# EAGLE design protoboard-63 (EAGLE 6.5.0)
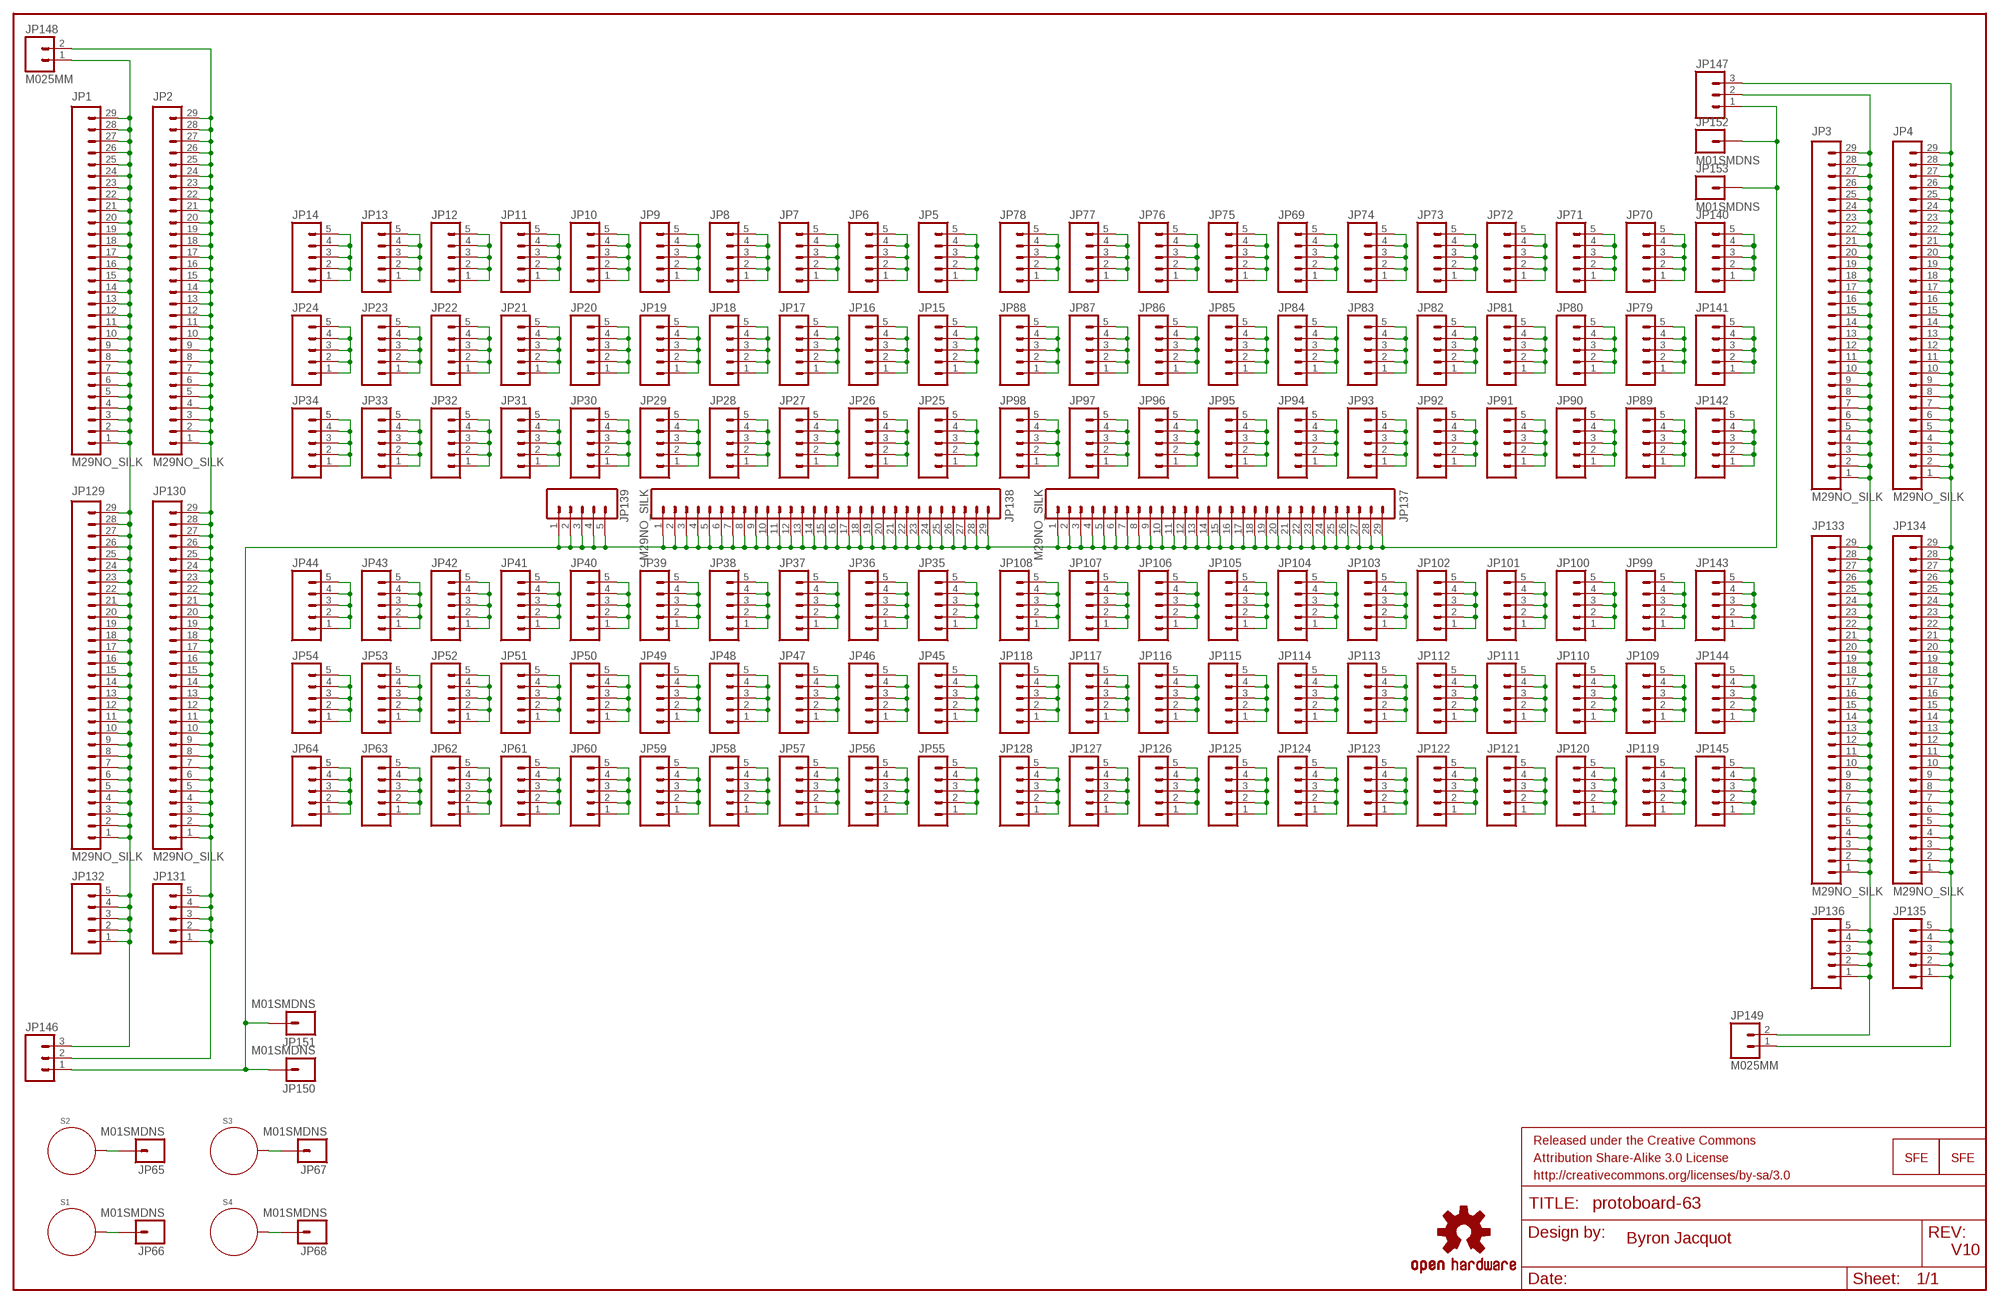
[diagram p0: schematic, sheet 1]

## Parts
FRAME2  FRAME-LEDGER  [CREATIVE_COMMONS]
JP1  M29NO_SILK  [1X29_NO_SILK]
JP2  M29NO_SILK  [1X29_NO_SILK]
JP3  M29NO_SILK  [1X29_NO_SILK]
JP4  M29NO_SILK  [1X29_NO_SILK]
JP5  M05NO_SILK  [1X05_NO_SILK]
JP6  M05NO_SILK  [1X05_NO_SILK]
JP7  M05NO_SILK  [1X05_NO_SILK]
JP8  M05NO_SILK  [1X05_NO_SILK]
JP9  M05NO_SILK  [1X05_NO_SILK]
JP10  M05NO_SILK  [1X05_NO_SILK]
JP11  M05NO_SILK  [1X05_NO_SILK]
JP12  M05NO_SILK  [1X05_NO_SILK]
JP13  M05NO_SILK  [1X05_NO_SILK]
JP14  M05NO_SILK  [1X05_NO_SILK]
JP15  M05NO_SILK  [1X05_NO_SILK]
JP16  M05NO_SILK  [1X05_NO_SILK]
JP17  M05NO_SILK  [1X05_NO_SILK]
JP18  M05NO_SILK  [1X05_NO_SILK]
JP19  M05NO_SILK  [1X05_NO_SILK]
JP20  M05NO_SILK  [1X05_NO_SILK]
JP21  M05NO_SILK  [1X05_NO_SILK]
JP22  M05NO_SILK  [1X05_NO_SILK]
JP23  M05NO_SILK  [1X05_NO_SILK]
JP24  M05NO_SILK  [1X05_NO_SILK]
JP25  M05NO_SILK  [1X05_NO_SILK]
JP26  M05NO_SILK  [1X05_NO_SILK]
JP27  M05NO_SILK  [1X05_NO_SILK]
JP28  M05NO_SILK  [1X05_NO_SILK]
JP29  M05NO_SILK  [1X05_NO_SILK]
JP30  M05NO_SILK  [1X05_NO_SILK]
JP31  M05NO_SILK  [1X05_NO_SILK]
JP32  M05NO_SILK  [1X05_NO_SILK]
JP33  M05NO_SILK  [1X05_NO_SILK]
JP34  M05NO_SILK  [1X05_NO_SILK]
JP35  M05NO_SILK  [1X05_NO_SILK]
JP36  M05NO_SILK  [1X05_NO_SILK]
JP37  M05NO_SILK  [1X05_NO_SILK]
JP38  M05NO_SILK  [1X05_NO_SILK]
JP39  M05NO_SILK  [1X05_NO_SILK]
JP40  M05NO_SILK  [1X05_NO_SILK]
JP41  M05NO_SILK  [1X05_NO_SILK]
JP42  M05NO_SILK  [1X05_NO_SILK]
JP43  M05NO_SILK  [1X05_NO_SILK]
JP44  M05NO_SILK  [1X05_NO_SILK]
JP45  M05NO_SILK  [1X05_NO_SILK]
JP46  M05NO_SILK  [1X05_NO_SILK]
JP47  M05NO_SILK  [1X05_NO_SILK]
JP48  M05NO_SILK  [1X05_NO_SILK]
JP49  M05NO_SILK  [1X05_NO_SILK]
JP50  M05NO_SILK  [1X05_NO_SILK]
JP51  M05NO_SILK  [1X05_NO_SILK]
JP52  M05NO_SILK  [1X05_NO_SILK]
JP53  M05NO_SILK  [1X05_NO_SILK]
JP54  M05NO_SILK  [1X05_NO_SILK]
JP55  M05NO_SILK  [1X05_NO_SILK]
JP56  M05NO_SILK  [1X05_NO_SILK]
JP57  M05NO_SILK  [1X05_NO_SILK]
JP58  M05NO_SILK  [1X05_NO_SILK]
JP59  M05NO_SILK  [1X05_NO_SILK]
JP60  M05NO_SILK  [1X05_NO_SILK]
JP61  M05NO_SILK  [1X05_NO_SILK]
JP62  M05NO_SILK  [1X05_NO_SILK]
JP63  M05NO_SILK  [1X05_NO_SILK]
JP64  M05NO_SILK  [1X05_NO_SILK]
JP65  M01SMDNS  [1X01NS]
JP66  M01SMDNS  [1X01NS]
JP67  M01SMDNS  [1X01NS]
JP68  M01SMDNS  [1X01NS]
JP69  M05NO_SILK  [1X05_NO_SILK]
JP70  M05NO_SILK  [1X05_NO_SILK]
JP71  M05NO_SILK  [1X05_NO_SILK]
JP72  M05NO_SILK  [1X05_NO_SILK]
JP73  M05NO_SILK  [1X05_NO_SILK]
JP74  M05NO_SILK  [1X05_NO_SILK]
JP75  M05NO_SILK  [1X05_NO_SILK]
JP76  M05NO_SILK  [1X05_NO_SILK]
JP77  M05NO_SILK  [1X05_NO_SILK]
JP78  M05NO_SILK  [1X05_NO_SILK]
JP79  M05NO_SILK  [1X05_NO_SILK]
JP80  M05NO_SILK  [1X05_NO_SILK]
JP81  M05NO_SILK  [1X05_NO_SILK]
JP82  M05NO_SILK  [1X05_NO_SILK]
JP83  M05NO_SILK  [1X05_NO_SILK]
JP84  M05NO_SILK  [1X05_NO_SILK]
JP85  M05NO_SILK  [1X05_NO_SILK]
JP86  M05NO_SILK  [1X05_NO_SILK]
JP87  M05NO_SILK  [1X05_NO_SILK]
JP88  M05NO_SILK  [1X05_NO_SILK]
JP89  M05NO_SILK  [1X05_NO_SILK]
JP90  M05NO_SILK  [1X05_NO_SILK]
JP91  M05NO_SILK  [1X05_NO_SILK]
JP92  M05NO_SILK  [1X05_NO_SILK]
JP93  M05NO_SILK  [1X05_NO_SILK]
JP94  M05NO_SILK  [1X05_NO_SILK]
JP95  M05NO_SILK  [1X05_NO_SILK]
JP96  M05NO_SILK  [1X05_NO_SILK]
JP97  M05NO_SILK  [1X05_NO_SILK]
JP98  M05NO_SILK  [1X05_NO_SILK]
JP99  M05NO_SILK  [1X05_NO_SILK]
JP100  M05NO_SILK  [1X05_NO_SILK]
JP101  M05NO_SILK  [1X05_NO_SILK]
JP102  M05NO_SILK  [1X05_NO_SILK]
JP103  M05NO_SILK  [1X05_NO_SILK]
JP104  M05NO_SILK  [1X05_NO_SILK]
JP105  M05NO_SILK  [1X05_NO_SILK]
JP106  M05NO_SILK  [1X05_NO_SILK]
JP107  M05NO_SILK  [1X05_NO_SILK]
JP108  M05NO_SILK  [1X05_NO_SILK]
JP109  M05NO_SILK  [1X05_NO_SILK]
JP110  M05NO_SILK  [1X05_NO_SILK]
JP111  M05NO_SILK  [1X05_NO_SILK]
JP112  M05NO_SILK  [1X05_NO_SILK]
JP113  M05NO_SILK  [1X05_NO_SILK]
JP114  M05NO_SILK  [1X05_NO_SILK]
JP115  M05NO_SILK  [1X05_NO_SILK]
JP116  M05NO_SILK  [1X05_NO_SILK]
JP117  M05NO_SILK  [1X05_NO_SILK]
JP118  M05NO_SILK  [1X05_NO_SILK]
JP119  M05NO_SILK  [1X05_NO_SILK]
JP120  M05NO_SILK  [1X05_NO_SILK]
JP121  M05NO_SILK  [1X05_NO_SILK]
JP122  M05NO_SILK  [1X05_NO_SILK]
JP123  M05NO_SILK  [1X05_NO_SILK]
JP124  M05NO_SILK  [1X05_NO_SILK]
JP125  M05NO_SILK  [1X05_NO_SILK]
JP126  M05NO_SILK  [1X05_NO_SILK]
JP127  M05NO_SILK  [1X05_NO_SILK]
JP128  M05NO_SILK  [1X05_NO_SILK]
JP129  M29NO_SILK  [1X29_NO_SILK]
JP130  M29NO_SILK  [1X29_NO_SILK]
JP131  M05NO_SILK  [1X05_NO_SILK]
JP132  M05NO_SILK  [1X05_NO_SILK]
JP133  M29NO_SILK  [1X29_NO_SILK]
JP134  M29NO_SILK  [1X29_NO_SILK]
JP135  M05NO_SILK  [1X05_NO_SILK]
JP136  M05NO_SILK  [1X05_NO_SILK]
JP137  M29NO_SILK  [1X29_NO_SILK]
JP138  M29NO_SILK  [1X29_NO_SILK]
JP139  M05NO_SILK  [1X05_NO_SILK]
JP140  M05NO_SILK  [1X05_NO_SILK]
JP141  M05NO_SILK  [1X05_NO_SILK]
JP142  M05NO_SILK  [1X05_NO_SILK]
JP143  M05NO_SILK  [1X05_NO_SILK]
JP144  M05NO_SILK  [1X05_NO_SILK]
JP145  M05NO_SILK  [1X05_NO_SILK]
JP146  M03-SCREW-5MM  [SCREWTERMINAL-5MM-3]
JP147  M03-SCREW-5MM  [SCREWTERMINAL-5MM-3]
JP148  M025MM  [SCREWTERMINAL-5MM-2]
JP149  M025MM  [SCREWTERMINAL-5MM-2]
JP150  M01SMDNS  [1X01NS]
JP151  M01SMDNS  [1X01NS]
JP152  M01SMDNS  [1X01NS]
JP153  M01SMDNS  [1X01NS]
LOGO1  LOGO-SFENEW  [SFE-NEW-WEBLOGO]
LOGO2  LOGO-SFENEW  [SFE-NEW-WEBLOGO]
LOGO3  OSHW-LOGOS  [OSHW-LOGO-S]
S1  STANDOFF_ELECTRICAL  [STANDOFF-ELECTRICAL]
S2  STANDOFF_ELECTRICAL  [STANDOFF-ELECTRICAL]
S3  STANDOFF_ELECTRICAL  [STANDOFF-ELECTRICAL]
S4  STANDOFF_ELECTRICAL  [STANDOFF-ELECTRICAL]

## Nets
GND: JP137.1 JP137.2 JP137.3 JP137.4 JP137.5 JP137.6 JP137.7 JP137.8 JP137.9 JP137.10 JP137.11 JP137.12 JP137.13 JP137.14 JP137.15 JP137.16 JP137.17 JP137.18 JP137.19 JP137.20 JP137.21 JP137.22 JP137.23 JP137.24 JP137.25 JP137.26 JP137.27 JP137.28 JP137.29 JP138.1 JP138.2 JP138.3 JP138.4 JP138.5 JP138.6 JP138.7 JP138.8 JP138.9 JP138.10 JP138.11 JP138.12 JP138.13 JP138.14 JP138.15 JP138.16 JP138.17 JP138.18 JP138.19 JP138.20 JP138.21 JP138.22 JP138.23 JP138.24 JP138.25 JP138.26 JP138.27 JP138.28 JP138.29 JP139.1 JP139.2 JP139.3 JP139.4 JP139.5 JP146.1 JP147.1 JP150.1 JP151.1 JP152.1 JP153.1
N$5: JP10.1 JP10.2 JP10.3 JP10.4 JP10.5
N$6: JP5.1 JP5.2 JP5.3 JP5.4 JP5.5
N$7: JP6.1 JP6.2 JP6.3 JP6.4 JP6.5
N$8: JP7.1 JP7.2 JP7.3 JP7.4 JP7.5
N$9: JP8.1 JP8.2 JP8.3 JP8.4 JP8.5
N$10: JP9.1 JP9.2 JP9.3 JP9.4 JP9.5
N$11: JP11.1 JP11.2 JP11.3 JP11.4 JP11.5
N$12: JP12.1 JP12.2 JP12.3 JP12.4 JP12.5
N$13: JP13.1 JP13.2 JP13.3 JP13.4 JP13.5
N$14: JP14.1 JP14.2 JP14.3 JP14.4 JP14.5
N$15: JP15.1 JP15.2 JP15.3 JP15.4 JP15.5
N$16: JP16.1 JP16.2 JP16.3 JP16.4 JP16.5
N$17: JP17.1 JP17.2 JP17.3 JP17.4 JP17.5
N$18: JP18.1 JP18.2 JP18.3 JP18.4 JP18.5
N$19: JP19.1 JP19.2 JP19.3 JP19.4 JP19.5
N$20: JP20.1 JP20.2 JP20.3 JP20.4 JP20.5
N$21: JP21.1 JP21.2 JP21.3 JP21.4 JP21.5
N$22: JP22.1 JP22.2 JP22.3 JP22.4 JP22.5
N$23: JP23.1 JP23.2 JP23.3 JP23.4 JP23.5
N$24: JP24.1 JP24.2 JP24.3 JP24.4 JP24.5
N$25: JP25.1 JP25.2 JP25.3 JP25.4 JP25.5
N$26: JP26.1 JP26.2 JP26.3 JP26.4 JP26.5
N$27: JP27.1 JP27.2 JP27.3 JP27.4 JP27.5
N$28: JP28.1 JP28.2 JP28.3 JP28.4 JP28.5
N$29: JP29.1 JP29.2 JP29.3 JP29.4 JP29.5
N$30: JP30.1 JP30.2 JP30.3 JP30.4 JP30.5
N$31: JP31.1 JP31.2 JP31.3 JP31.4 JP31.5
N$32: JP32.1 JP32.2 JP32.3 JP32.4 JP32.5
N$33: JP33.1 JP33.2 JP33.3 JP33.4 JP33.5
N$34: JP34.1 JP34.2 JP34.3 JP34.4 JP34.5
N$35: JP35.1 JP35.2 JP35.3 JP35.4 JP35.5
N$36: JP36.1 JP36.2 JP36.3 JP36.4 JP36.5
N$37: JP37.1 JP37.2 JP37.3 JP37.4 JP37.5
N$38: JP38.1 JP38.2 JP38.3 JP38.4 JP38.5
N$39: JP39.1 JP39.2 JP39.3 JP39.4 JP39.5
N$40: JP40.1 JP40.2 JP40.3 JP40.4 JP40.5
N$41: JP41.1 JP41.2 JP41.3 JP41.4 JP41.5
N$42: JP42.1 JP42.2 JP42.3 JP42.4 JP42.5
N$43: JP43.1 JP43.2 JP43.3 JP43.4 JP43.5
N$44: JP44.1 JP44.2 JP44.3 JP44.4 JP44.5
N$45: JP45.1 JP45.2 JP45.3 JP45.4 JP45.5
N$46: JP46.1 JP46.2 JP46.3 JP46.4 JP46.5
N$47: JP47.1 JP47.2 JP47.3 JP47.4 JP47.5
N$48: JP48.1 JP48.2 JP48.3 JP48.4 JP48.5
N$49: JP49.1 JP49.2 JP49.3 JP49.4 JP49.5
N$50: JP50.1 JP50.2 JP50.3 JP50.4 JP50.5
N$51: JP51.1 JP51.2 JP51.3 JP51.4 JP51.5
N$52: JP52.1 JP52.2 JP52.3 JP52.4 JP52.5
N$53: JP53.1 JP53.2 JP53.3 JP53.4 JP53.5
N$54: JP54.1 JP54.2 JP54.3 JP54.4 JP54.5
N$55: JP55.1 JP55.2 JP55.3 JP55.4 JP55.5
N$56: JP56.1 JP56.2 JP56.3 JP56.4 JP56.5
N$57: JP57.1 JP57.2 JP57.3 JP57.4 JP57.5
N$58: JP58.1 JP58.2 JP58.3 JP58.4 JP58.5
N$59: JP59.1 JP59.2 JP59.3 JP59.4 JP59.5
N$60: JP60.1 JP60.2 JP60.3 JP60.4 JP60.5
N$61: JP61.1 JP61.2 JP61.3 JP61.4 JP61.5
N$62: JP62.1 JP62.2 JP62.3 JP62.4 JP62.5
N$63: JP63.1 JP63.2 JP63.3 JP63.4 JP63.5
N$64: JP64.1 JP64.2 JP64.3 JP64.4 JP64.5
N$65: JP65.1 S2.P1
N$66: JP66.1 S1.P1
N$67: JP67.1 S3.P1
N$68: JP68.1 S4.P1
N$69: JP69.1 JP69.2 JP69.3 JP69.4 JP69.5
N$70: JP70.1 JP70.2 JP70.3 JP70.4 JP70.5
N$71: JP71.1 JP71.2 JP71.3 JP71.4 JP71.5
N$72: JP72.1 JP72.2 JP72.3 JP72.4 JP72.5
N$73: JP73.1 JP73.2 JP73.3 JP73.4 JP73.5
N$74: JP74.1 JP74.2 JP74.3 JP74.4 JP74.5
N$75: JP75.1 JP75.2 JP75.3 JP75.4 JP75.5
N$76: JP76.1 JP76.2 JP76.3 JP76.4 JP76.5
N$77: JP77.1 JP77.2 JP77.3 JP77.4 JP77.5
N$78: JP78.1 JP78.2 JP78.3 JP78.4 JP78.5
N$79: JP79.1 JP79.2 JP79.3 JP79.4 JP79.5
N$80: JP80.1 JP80.2 JP80.3 JP80.4 JP80.5
N$81: JP81.1 JP81.2 JP81.3 JP81.4 JP81.5
N$82: JP82.1 JP82.2 JP82.3 JP82.4 JP82.5
N$83: JP83.1 JP83.2 JP83.3 JP83.4 JP83.5
N$84: JP84.1 JP84.2 JP84.3 JP84.4 JP84.5
N$85: JP85.1 JP85.2 JP85.3 JP85.4 JP85.5
N$86: JP86.1 JP86.2 JP86.3 JP86.4 JP86.5
N$87: JP87.1 JP87.2 JP87.3 JP87.4 JP87.5
N$88: JP88.1 JP88.2 JP88.3 JP88.4 JP88.5
N$89: JP89.1 JP89.2 JP89.3 JP89.4 JP89.5
N$90: JP90.1 JP90.2 JP90.3 JP90.4 JP90.5
N$91: JP91.1 JP91.2 JP91.3 JP91.4 JP91.5
N$92: JP92.1 JP92.2 JP92.3 JP92.4 JP92.5
N$93: JP93.1 JP93.2 JP93.3 JP93.4 JP93.5
N$94: JP94.1 JP94.2 JP94.3 JP94.4 JP94.5
N$95: JP95.1 JP95.2 JP95.3 JP95.4 JP95.5
N$96: JP96.1 JP96.2 JP96.3 JP96.4 JP96.5
N$97: JP97.1 JP97.2 JP97.3 JP97.4 JP97.5
N$98: JP98.1 JP98.2 JP98.3 JP98.4 JP98.5
N$99: JP99.1 JP99.2 JP99.3 JP99.4 JP99.5
N$100: JP100.1 JP100.2 JP100.3 JP100.4 JP100.5
N$101: JP101.1 JP101.2 JP101.3 JP101.4 JP101.5
N$102: JP102.1 JP102.2 JP102.3 JP102.4 JP102.5
N$103: JP103.1 JP103.2 JP103.3 JP103.4 JP103.5
N$104: JP104.1 JP104.2 JP104.3 JP104.4 JP104.5
N$105: JP105.1 JP105.2 JP105.3 JP105.4 JP105.5
N$106: JP106.1 JP106.2 JP106.3 JP106.4 JP106.5
N$107: JP107.1 JP107.2 JP107.3 JP107.4 JP107.5
N$108: JP108.1 JP108.2 JP108.3 JP108.4 JP108.5
N$109: JP109.1 JP109.2 JP109.3 JP109.4 JP109.5
N$110: JP110.1 JP110.2 JP110.3 JP110.4 JP110.5
N$111: JP111.1 JP111.2 JP111.3 JP111.4 JP111.5
N$112: JP112.1 JP112.2 JP112.3 JP112.4 JP112.5
N$113: JP113.1 JP113.2 JP113.3 JP113.4 JP113.5
N$114: JP114.1 JP114.2 JP114.3 JP114.4 JP114.5
N$115: JP115.1 JP115.2 JP115.3 JP115.4 JP115.5
N$116: JP116.1 JP116.2 JP116.3 JP116.4 JP116.5
N$117: JP117.1 JP117.2 JP117.3 JP117.4 JP117.5
N$118: JP118.1 JP118.2 JP118.3 JP118.4 JP118.5
N$119: JP119.1 JP119.2 JP119.3 JP119.4 JP119.5
N$120: JP120.1 JP120.2 JP120.3 JP120.4 JP120.5
N$121: JP121.1 JP121.2 JP121.3 JP121.4 JP121.5
N$122: JP122.1 JP122.2 JP122.3 JP122.4 JP122.5
N$123: JP123.1 JP123.2 JP123.3 JP123.4 JP123.5
N$124: JP124.1 JP124.2 JP124.3 JP124.4 JP124.5
N$125: JP125.1 JP125.2 JP125.3 JP125.4 JP125.5
N$126: JP126.1 JP126.2 JP126.3 JP126.4 JP126.5
N$127: JP127.1 JP127.2 JP127.3 JP127.4 JP127.5
N$128: JP128.1 JP128.2 JP128.3 JP128.4 JP128.5
N$130: JP140.1 JP140.2 JP140.3 JP140.4 JP140.5
N$131: JP141.1 JP141.2 JP141.3 JP141.4 JP141.5
N$132: JP142.1 JP142.2 JP142.3 JP142.4 JP142.5
N$133: JP143.1 JP143.2 JP143.3 JP143.4 JP143.5
N$134: JP144.1 JP144.2 JP144.3 JP144.4 JP144.5
N$135: JP145.1 JP145.2 JP145.3 JP145.4 JP145.5
V+BOT: JP4.1 JP4.2 JP4.3 JP4.4 JP4.5 JP4.6 JP4.7 JP4.8 JP4.9 JP4.10 JP4.11 JP4.12 JP4.13 JP4.14 JP4.15 JP4.16 JP4.17 JP4.18 JP4.19 JP4.20 JP4.21 JP4.22 JP4.23 JP4.24 JP4.25 JP4.26 JP4.27 JP4.28 JP4.29 JP134.1 JP134.2 JP134.3 JP134.4 JP134.5 JP134.6 JP134.7 JP134.8 JP134.9 JP134.10 JP134.11 JP134.12 JP134.13 JP134.14 JP134.15 JP134.16 JP134.17 JP134.18 JP134.19 JP134.20 JP134.21 JP134.22 JP134.23 JP134.24 JP134.25 JP134.26 JP134.27 JP134.28 JP134.29 JP135.1 JP135.2 JP135.3 JP135.4 JP135.5 JP147.3 JP149.1
V+TOP: JP2.1 JP2.2 JP2.3 JP2.4 JP2.5 JP2.6 JP2.7 JP2.8 JP2.9 JP2.10 JP2.11 JP2.12 JP2.13 JP2.14 JP2.15 JP2.16 JP2.17 JP2.18 JP2.19 JP2.20 JP2.21 JP2.22 JP2.23 JP2.24 JP2.25 JP2.26 JP2.27 JP2.28 JP2.29 JP130.1 JP130.2 JP130.3 JP130.4 JP130.5 JP130.6 JP130.7 JP130.8 JP130.9 JP130.10 JP130.11 JP130.12 JP130.13 JP130.14 JP130.15 JP130.16 JP130.17 JP130.18 JP130.19 JP130.20 JP130.21 JP130.22 JP130.23 JP130.24 JP130.25 JP130.26 JP130.27 JP130.28 JP130.29 JP131.1 JP131.2 JP131.3 JP131.4 JP131.5 JP146.2 JP148.2
V-BOT: JP3.1 JP3.2 JP3.3 JP3.4 JP3.5 JP3.6 JP3.7 JP3.8 JP3.9 JP3.10 JP3.11 JP3.12 JP3.13 JP3.14 JP3.15 JP3.16 JP3.17 JP3.18 JP3.19 JP3.20 JP3.21 JP3.22 JP3.23 JP3.24 JP3.25 JP3.26 JP3.27 JP3.28 JP3.29 JP133.1 JP133.2 JP133.3 JP133.4 JP133.5 JP133.6 JP133.7 JP133.8 JP133.9 JP133.10 JP133.11 JP133.12 JP133.13 JP133.14 JP133.15 JP133.16 JP133.17 JP133.18 JP133.19 JP133.20 JP133.21 JP133.22 JP133.23 JP133.24 JP133.25 JP133.26 JP133.27 JP133.28 JP133.29 JP136.1 JP136.2 JP136.3 JP136.4 JP136.5 JP147.2 JP149.2
V-TOP: JP1.1 JP1.2 JP1.3 JP1.4 JP1.5 JP1.6 JP1.7 JP1.8 JP1.9 JP1.10 JP1.11 JP1.12 JP1.13 JP1.14 JP1.15 JP1.16 JP1.17 JP1.18 JP1.19 JP1.20 JP1.21 JP1.22 JP1.23 JP1.24 JP1.25 JP1.26 JP1.27 JP1.28 JP1.29 JP129.1 JP129.2 JP129.3 JP129.4 JP129.5 JP129.6 JP129.7 JP129.8 JP129.9 JP129.10 JP129.11 JP129.12 JP129.13 JP129.14 JP129.15 JP129.16 JP129.17 JP129.18 JP129.19 JP129.20 JP129.21 JP129.22 JP129.23 JP129.24 JP129.25 JP129.26 JP129.27 JP129.28 JP129.29 JP132.1 JP132.2 JP132.3 JP132.4 JP132.5 JP146.3 JP148.1

## Notes on the sheet
- Byron Jacquot
- V10

## Library data of the parts
FRAME2 = SparkFun-Aesthetics:FRAME-LEDGER: Schematic Frame Standard 11x14 US Ledger frame
JP1-JP4 JP129 JP130 JP133 JP134 JP137 JP138 = SparkFun-Connectors:M29: 1x29 .1" header
JP5-JP64 JP69-JP128 JP131 JP132 JP135 JP136 JP139-JP145 = SparkFun-Connectors:M05: Header 5 Standard 5-pin 0.1" header. Use with straight break away headers (SKU : PRT-00116), right angle break away headers (PRT-00553), swiss pins (PRT-00743), machine pins (PRT-00117), and female headers (PRT-00115). Molex polarized connector foot print use with SKU : PRT-08230 with associated crimp pins and housings.
JP65-JP68 JP150-JP153 = SparkFun-Connectors:M01: Header 1 Standard 1-pin 0.1" header. Use with straight break away headers (SKU : PRT-00116), right angle break away headers (PRT-00553), swiss pins (PRT-00743), machine pins (PRT-00117), and female headers (PRT-00115).
JP146 JP147 = SparkFun-Connectors:M03: Header 3 Standard 3-pin 0.1" header. Use with straight break away headers (SKU : PRT-00116), right angle break away headers (PRT-00553), swiss pins (PRT-00743), machine pins (PRT-00117), and female headers (PRT-00115). Molex polarized connector foot print use with SKU : PRT-08232 with associated crimp pins and housings.
JP148 JP149 = SparkFun-Connectors:M02: Standard 2-pin 0.1" header. Use with - straight break away headers ( PRT-00116) - right angle break away headers (PRT-00553) - swiss pins (PRT-00743) - machine pins (PRT-00117) - female headers (PRT-00115) Molex polarized connector foot print use with: PRT-08233 with associated crimp pins and housings. 2.54_SCREWTERM for use with PRT-10571. 3.5mm Screw Terminal footprints for PRT-08084 5mm Screw Terminal footprints for use with PRT-08433
LOGO1 LOGO2 = SparkFun-Aesthetics:LOGO-SFE: Spark Fun Electronics PCB Logo This is the standard Spark Fun Electronics PCB logo.
LOGO3 = SparkFun-Aesthetics:OSHW-LOGO: Open Source Hardware Logo This logo indicates the piece of hardware it is found on incorporates a OSHW license and/or adheres to the definition of open source hardware found here: http://freedomdefined.org/OSHW
S1-S4 = SparkFun-Electromechanical:STANDOFF_ELECTRICAL: A standoff intended to be an electrically connected point. Pad size and stop size allow for a #4 Phillips pan screw head to make a solid connection to the board.

## Board
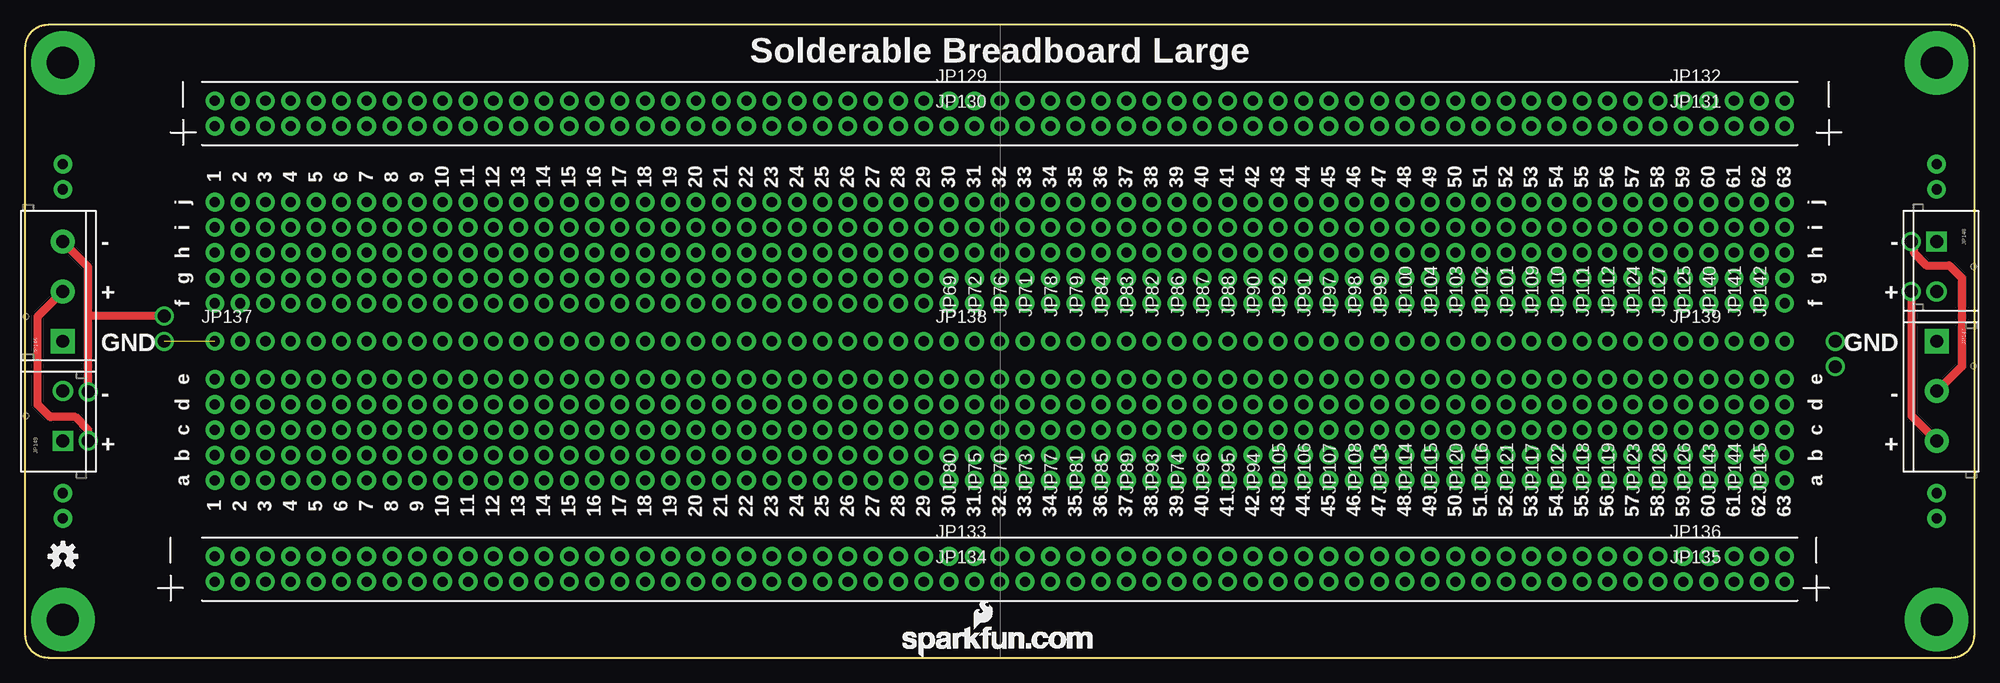
[diagram p1: board, top side]
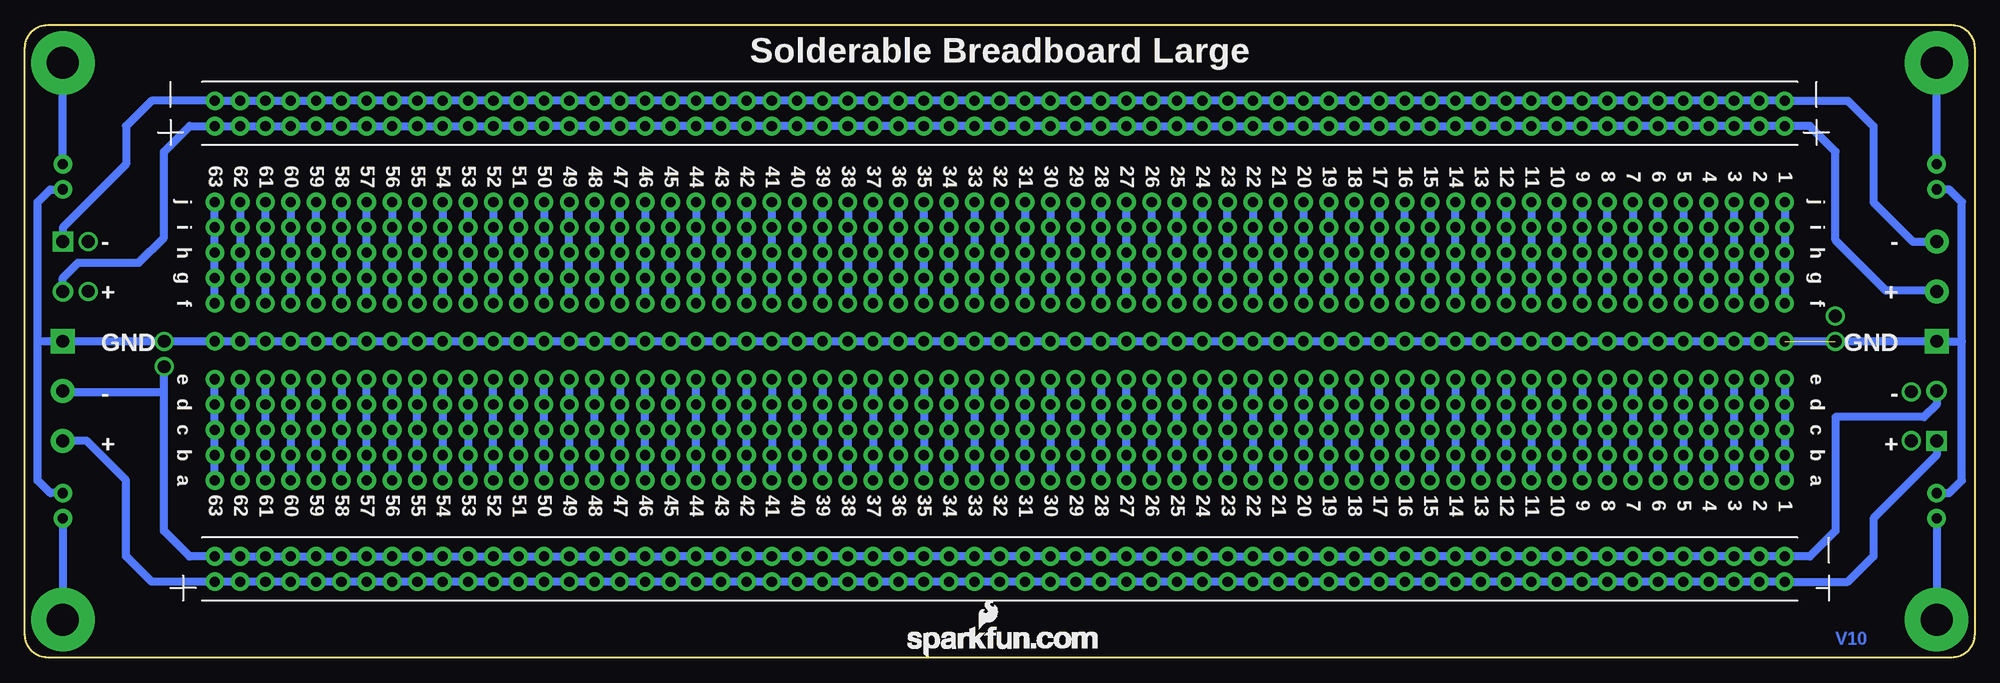
[diagram p2: board, bottom side, seen from below]

Size 195.58 x 63.5 mm. Coordinates in mm from the lower left corner, seen from the top.
Outline: 0,61.18 0,2.32 arc90 2.32,0 193.26,0 arc90 195.58,2.32 195.58,61.18 arc90 193.26,63.5 2.32,63.5 arc90 0,61.18
Copper layers (1*16): Top 0.035mm / dielectric 1.5mm / Bottom 0.035mm
Design rules "SparkFun-2-layer": minimum track width 7mil, minimum drill 15mil, track to track 8mil, track to pad 8mil, pad to pad 8mil, via to via 8mil, smd to smd 8mil, copper to edge 8mil, drill to drill 8mil, minimum pad ring 12mil, minimum via ring 10mil, stop-mask expansion 4mil, vias tented up to drill 20mil, thermal gap 10mil

### Footprints (pad centres in the part's own frame; a part is rotated, then mirrored left to right if it is on the bottom)
1X29_NO_SILK = drill 1.016 pad 1.88: 1 0,0; 2 2.54,0; 3 5.08,0; 4 7.62,0; 5 10.16,0; 6 12.7,0; 7 15.24,0; 8 17.78,0; 9 20.32,0; 10 22.86,0; 11 25.4,0; 12 27.94,0; 13 30.48,0; 14 33.02,0; 15 35.56,0; 16 38.1,0; 17 40.64,0; 18 43.18,0; 19 45.72,0; 20 48.26,0; 21 50.8,0; 22 53.34,0; 23 55.88,0; 24 58.42,0; 25 60.96,0; 26 63.5,0; 27 66.04,0; 28 68.58,0; 29 71.12,0
1X05_NO_SILK = drill 1.016 pad 1.88: 1 0,0; 2 2.54,0; 3 5.08,0; 4 7.62,0; 5 10.16,0
1X01NS = drill 1.016 pad 1.88: 1 0,0
SCREWTERMINAL-5MM-3 = drill 1.3 pad 2.413 square: 1 0,0 | drill 1.3 pad 2.413: 2 5,0; 3 10,0
SCREWTERMINAL-5MM-2 = drill 1.3 pad 2.032 square: 1 0,0 | drill 1.3 pad 2.032: 2 5,0
STANDOFF-ELECTRICAL = drill 3.2 pad 6.35: P1 0,0

### Placement (x,y rotation side)
FRAME2  21.59,-11.43 0 top  (outside the outline)
JP1  19.05,55.88 0 top
JP2  19.05,53.34 0 top
JP3  19.05,10.16 0 top
JP4  19.05,7.62 0 top
JP5  19.05,17.78 90 top
JP6  21.59,17.78 90 top
JP7  24.13,17.78 90 top
JP8  26.67,17.78 90 top
JP9  29.21,17.78 90 top
JP10  31.75,17.78 90 top
JP11  34.29,17.78 90 top
JP12  36.83,17.78 90 top
JP13  39.37,17.78 90 top
JP14  41.91,17.78 90 top
JP15  44.45,17.78 90 top
JP16  46.99,17.78 90 top
JP17  49.53,17.78 90 top
JP18  52.07,17.78 90 top
JP19  54.61,17.78 90 top
JP20  57.15,17.78 90 top
JP21  59.69,17.78 90 top
JP22  62.23,17.78 90 top
JP23  64.77,17.78 90 top
JP24  67.31,17.78 90 top
JP25  69.85,17.78 90 top
JP26  72.39,17.78 90 top
JP27  74.93,17.78 90 top
JP28  77.47,17.78 90 top
JP29  80.01,17.78 90 top
JP30  82.55,17.78 90 top
JP31  85.09,17.78 90 top
JP32  87.63,17.78 90 top
JP33  90.17,17.78 90 top
JP34  92.71,17.78 90 top
JP35  19.05,35.56 90 top
JP36  21.59,35.56 90 top
JP37  24.13,35.56 90 top
JP38  26.67,35.56 90 top
JP39  29.21,35.56 90 top
JP40  31.75,35.56 90 top
JP41  34.29,35.56 90 top
JP42  36.83,35.56 90 top
JP43  39.37,35.56 90 top
JP44  41.91,35.56 90 top
JP45  44.45,35.56 90 top
JP46  49.53,35.56 90 top
JP47  46.99,35.56 90 top
JP48  52.07,35.56 90 top
JP49  54.61,35.56 90 top
JP50  57.15,35.56 90 top
JP51  59.69,35.56 90 top
JP52  62.23,35.56 90 top
JP53  64.77,35.56 90 top
JP54  67.31,35.56 90 top
JP55  69.85,35.56 90 top
JP56  72.39,35.56 90 top
JP57  74.93,35.56 90 top
JP58  77.47,35.56 90 top
JP59  80.01,35.56 90 top
JP60  82.55,35.56 90 top
JP61  85.09,35.56 90 top
JP62  87.63,35.56 90 top
JP63  90.17,35.56 90 top
JP64  92.71,35.56 90 top
JP65  191.77,49.53 0 top
JP66  3.81,49.53 0 top
JP67  3.81,13.97 0 top
JP68  191.77,13.97 0 top
JP69  95.25,35.56 90 top
JP70  100.33,17.78 90 top
JP71  102.87,35.56 90 top
JP72  97.79,35.56 90 top
JP73  102.87,17.78 90 top
JP74  118.11,17.78 90 top
JP75  97.79,17.78 90 top
JP76  100.33,35.56 90 top
JP77  105.41,17.78 90 top
JP78  105.41,35.56 90 top
JP79  107.95,35.56 90 top
JP80  95.25,17.78 90 top
JP81  107.95,17.78 90 top
JP82  115.57,35.56 90 top
JP83  113.03,35.56 90 top
JP84  110.49,35.56 90 top
JP85  110.49,17.78 90 top
JP86  118.11,35.56 90 top
JP87  120.65,35.56 90 top
JP88  123.19,35.56 90 top
JP89  113.03,17.78 90 top
JP90  125.73,35.56 90 top
JP91  130.81,35.56 90 top
JP92  128.27,35.56 90 top
JP93  115.57,17.78 90 top
JP94  125.73,17.78 90 top
JP95  123.19,17.78 90 top
JP96  120.65,17.78 90 top
JP97  133.35,35.56 90 top
JP98  135.89,35.56 90 top
JP99  138.43,35.56 90 top
JP100  140.97,35.56 90 top
JP101  151.13,35.56 90 top
JP102  148.59,35.56 90 top
JP103  146.05,35.56 90 top
JP104  143.51,35.56 90 top
JP105  128.27,17.78 90 top
JP106  130.81,17.78 90 top
JP107  133.35,17.78 90 top
JP108  135.89,17.78 90 top
JP109  153.67,35.56 90 top
JP110  156.21,35.56 90 top
JP111  158.75,35.56 90 top
JP112  161.29,35.56 90 top
JP113  138.43,17.78 90 top
JP114  140.97,17.78 90 top
JP115  143.51,17.78 90 top
JP116  148.59,17.78 90 top
JP117  153.67,17.78 90 top
JP118  158.75,17.78 90 top
JP119  161.29,17.78 90 top
JP120  146.05,17.78 90 top
JP121  151.13,17.78 90 top
JP122  156.21,17.78 90 top
JP123  163.83,17.78 90 top
JP124  163.83,35.56 90 top
JP125  168.91,35.56 90 top
JP126  168.91,17.78 90 top
JP127  166.37,35.56 90 top
JP128  166.37,17.78 90 top
JP129  92.71,55.88 0 top
JP130  92.71,53.34 0 top
JP131  166.37,53.34 0 top
JP132  166.37,55.88 0 top
JP133  92.71,10.16 0 top
JP134  92.71,7.62 0 top
JP135  166.37,7.62 0 top
JP136  166.37,10.16 0 top
JP137  19.05,31.75 0 top
JP138  92.71,31.75 0 top
JP139  166.37,31.75 0 top
JP140  171.45,35.56 90 top
JP141  173.99,35.56 90 top
JP142  176.53,35.56 90 top
JP143  171.45,17.78 90 top
JP144  173.99,17.78 90 top
JP145  176.53,17.78 90 top
JP146  3.81,31.75 90 top
JP147  191.77,31.75 270 top
JP148  191.77,41.75 270 top
JP149  3.81,21.75 90 top
JP150  3.81,46.99 0 top
JP151  3.81,16.51 0 top
JP152  191.77,46.99 0 top
JP153  191.77,16.51 0 top
LOGO1  107.06,0 0 bottom
LOGO2  88.01,0 0 top
LOGO3  3.81,10.16 0 top
S1  3.81,59.69 0 top
S2  191.77,59.69 0 top
S3  3.81,3.81 0 top
S4  191.77,3.81 0 top

### Tracks (layer width: path | path; a pad name or v marks a point on that pad's centre or on a via)
GND  (via drill 1.27 pad 1.91)  (1 unrouted)
  Bottom 0.813: JP151.1 2.54,16.51 1.27,17.78 1.27,31.75 | 1.27,31.75 1.27,45.72 2.54,46.99 JP150.1 | 1.27,31.75 JP146.1 JP137.1 JP137.2 JP137.3 JP137.4 JP137.5 JP137.6 JP137.7 JP137.8 JP137.9 JP137.10 JP137.11 JP137.12 JP137.13 JP137.14 JP137.15 JP137.16 JP137.17 JP137.18 JP137.19 JP137.20 JP137.21 JP137.22 JP137.23 JP137.24 JP137.25 JP137.26 JP137.27 JP137.28 JP137.29 JP138.1 JP138.2 JP138.3 JP138.4 JP138.5 JP138.6 JP138.7 JP138.8 JP138.9 JP138.10 JP138.11 JP138.12 JP138.13 JP138.14 JP138.15 JP138.16 JP138.17 JP138.18 JP138.19 JP138.20 JP138.21 JP138.22 JP138.23 JP138.24 JP138.25 JP138.26 JP138.27 JP138.28 JP138.29 JP139.1 JP139.2 JP139.3 JP139.4 JP139.5 v181.61,31.75 JP147.1 194.31,31.75 | JP153.1 193.04,16.51 194.31,17.78 194.31,31.75 | 194.31,31.75 194.31,45.72 193.04,46.99 JP152.1
  other vias: 13.97,31.75
N$5
  Bottom 0.813: JP10.1 JP10.2 JP10.3 JP10.4 JP10.5
N$6
  Bottom 0.813: JP5.5 JP5.4 JP5.3 JP5.2 JP5.1
N$7
  Bottom 0.813: JP6.1 JP6.2 JP6.3 JP6.4 JP6.5
N$8
  Bottom 0.813: JP7.5 JP7.4 JP7.3 JP7.2 JP7.1
N$9
  Bottom 0.813: JP8.1 JP8.2 JP8.3 JP8.4 JP8.5
N$10
  Bottom 0.813: JP9.5 JP9.4 JP9.3 JP9.2 JP9.1
N$11
  Bottom 0.813: JP11.5 JP11.4 JP11.3 JP11.2 JP11.1
N$12
  Bottom 0.813: JP12.1 JP12.2 JP12.3 JP12.4 JP12.5
N$13
  Bottom 0.813: JP13.5 JP13.4 JP13.3 JP13.2 JP13.1
N$14
  Bottom 0.813: JP14.1 JP14.2 JP14.3 JP14.4 JP14.5
N$15
  Bottom 0.813: JP15.5 JP15.4 JP15.3 JP15.2 JP15.1
N$16
  Bottom 0.813: JP16.1 JP16.2 JP16.3 JP16.4 JP16.5
N$17
  Bottom 0.813: JP17.1 JP17.2 JP17.3 JP17.4 JP17.5
N$18
  Bottom 0.813: JP18.5 JP18.4 JP18.3 JP18.2 JP18.1
N$19
  Bottom 0.813: JP19.1 JP19.2 JP19.3 JP19.4 JP19.5
N$20
  Bottom 0.813: JP20.5 JP20.4 JP20.3 JP20.2 JP20.1
N$21
  Bottom 0.813: JP21.1 JP21.2 JP21.3 JP21.4 JP21.5
N$22
  Bottom 0.813: JP22.5 JP22.4 JP22.3 JP22.2 JP22.1
N$23
  Bottom 0.813: JP23.1 JP23.2 JP23.3 JP23.4 JP23.5
N$24
  Bottom 0.813: JP24.5 JP24.4 JP24.3 JP24.2 JP24.1
N$25
  Bottom 0.813: JP25.1 JP25.2 JP25.3 JP25.4 JP25.5
N$26
  Bottom 0.813: JP26.5 JP26.4 JP26.3 JP26.2 JP26.1
N$27
  Bottom 0.813: JP27.1 JP27.2 JP27.3 JP27.4 JP27.5
N$28
  Bottom 0.813: JP28.5 JP28.4 JP28.3 JP28.2 JP28.1
N$29
  Bottom 0.813: JP29.1 JP29.2 JP29.3 JP29.4 JP29.5
N$30
  Bottom 0.813: JP30.5 JP30.4 JP30.3 JP30.2 JP30.1
N$31
  Bottom 0.813: JP31.1 JP31.2 JP31.3 JP31.4 JP31.5
N$32
  Bottom 0.813: JP32.5 JP32.4 JP32.3 JP32.2 JP32.1
N$33
  Bottom 0.813: JP33.1 JP33.2 JP33.3 JP33.4 JP33.5
N$34
  Bottom 0.813: JP34.5 JP34.4 JP34.3 JP34.2 JP34.1
N$35
  Bottom 0.813: JP35.5 JP35.4 JP35.3 JP35.2 JP35.1
N$36
  Bottom 0.813: JP36.1 JP36.2 JP36.3 JP36.4 JP36.5
N$37
  Bottom 0.813: JP37.5 JP37.4 JP37.3 JP37.2 JP37.1
N$38
  Bottom 0.813: JP38.1 JP38.2 JP38.3 JP38.4 JP38.5
N$39
  Bottom 0.813: JP39.5 JP39.4 JP39.3 JP39.2 JP39.1
N$40
  Bottom 0.813: JP40.1 JP40.2 JP40.3 JP40.4 JP40.5
N$41
  Bottom 0.813: JP41.5 JP41.4 JP41.3 JP41.2 JP41.1
N$42
  Bottom 0.813: JP42.1 JP42.2 JP42.3 JP42.4 JP42.5
N$43
  Bottom 0.813: JP43.5 JP43.4 JP43.3 JP43.2 JP43.1
N$44
  Bottom 0.813: JP44.1 JP44.2 JP44.3 JP44.4 JP44.5
N$45
  Bottom 0.813: JP45.5 JP45.4 JP45.3 JP45.2 JP45.1
N$46
  Bottom 0.813: JP46.5 JP46.4 JP46.3 JP46.2 JP46.1
N$47
  Bottom 0.813: JP47.1 JP47.2 JP47.3 JP47.4 JP47.5
N$48
  Bottom 0.813: JP48.1 JP48.2 JP48.3 JP48.4 JP48.5
N$49
  Bottom 0.813: JP49.5 JP49.4 JP49.3 JP49.2 JP49.1
N$50
  Bottom 0.813: JP50.1 JP50.2 JP50.3 JP50.4 JP50.5
N$51
  Bottom 0.813: JP51.5 JP51.4 JP51.3 JP51.2 JP51.1
N$52
  Bottom 0.813: JP52.1 JP52.2 JP52.3 JP52.4 JP52.5
N$53
  Bottom 0.813: JP53.5 JP53.4 JP53.3 JP53.2 JP53.1
N$54
  Bottom 0.813: JP54.5 JP54.4 JP54.3 JP54.2 JP54.1
N$55
  Bottom 0.813: JP55.1 JP55.2 JP55.3 JP55.4 JP55.5
N$56
  Bottom 0.813: JP56.5 JP56.4 JP56.3 JP56.2 JP56.1
N$57
  Bottom 0.813: JP57.1 JP57.2 JP57.3 JP57.4 JP57.5
N$58
  Bottom 0.813: JP58.5 JP58.4 JP58.3 JP58.2 JP58.1
N$59
  Bottom 0.813: JP59.1 JP59.2 JP59.3 JP59.4 JP59.5
N$60
  Bottom 0.813: JP60.5 JP60.4 JP60.3 JP60.2 JP60.1
N$61
  Bottom 0.813: JP61.1 JP61.2 JP61.3 JP61.4 JP61.5
N$62
  Bottom 0.813: JP62.5 JP62.4 JP62.3 JP62.2 JP62.1
N$63
  Bottom 0.813: JP63.1 JP63.2 JP63.3 JP63.4 JP63.5
N$64
  Bottom 0.813: JP64.5 JP64.4 JP64.3 JP64.2 JP64.1
N$65
  Bottom 0.813: JP65.1 S2.P1
N$66
  Bottom 0.813: JP66.1 S1.P1
N$67
  Bottom 0.813: JP67.1 S3.P1
N$68
  Bottom 0.813: JP68.1 S4.P1
N$69
  Bottom 0.813: JP69.5 JP69.4 JP69.3 JP69.2 JP69.1
N$70
  Bottom 0.813: JP70.5 JP70.4 JP70.3 JP70.2 JP70.1
N$71
  Bottom 0.813: JP71.1 JP71.2 JP71.3 JP71.4 JP71.5
N$72
  Bottom 0.813: JP72.1 JP72.2 JP72.3 JP72.4 JP72.5
N$73
  Bottom 0.813: JP73.1 JP73.2 JP73.3 JP73.4 JP73.5
N$74
  Bottom 0.813: JP74.1 JP74.2 JP74.3 JP74.4 JP74.5
N$75
  Bottom 0.813: JP75.1 JP75.2 JP75.3 JP75.4 JP75.5
N$76
  Bottom 0.813: JP76.5 JP76.4 JP76.3 JP76.2 JP76.1
N$77
  Bottom 0.813: JP77.5 JP77.4 JP77.3 JP77.2 JP77.1
N$78
  Bottom 0.813: JP78.1 JP78.2 JP78.3 JP78.4 JP78.5
N$79
  Bottom 0.813: JP79.5 JP79.4 JP79.3 JP79.2 JP79.1
N$80
  Bottom 0.813: JP80.1 JP80.2 JP80.3 JP80.4 JP80.5
N$81
  Bottom 0.813: JP81.1 JP81.2 JP81.3 JP81.4 JP81.5
N$82
  Bottom 0.813: JP82.1 JP82.2 JP82.3 JP82.4 JP82.5
N$83
  Bottom 0.813: JP83.5 JP83.4 JP83.3 JP83.2 JP83.1
N$84
  Bottom 0.813: JP84.1 JP84.2 JP84.3 JP84.4 JP84.5
N$85
  Bottom 0.813: JP85.5 JP85.4 JP85.3 JP85.2 JP85.1
N$86
  Bottom 0.813: JP86.5 JP86.4 JP86.3 JP86.2 JP86.1
N$87
  Bottom 0.813: JP87.1 JP87.2 JP87.3 JP87.4 JP87.5
N$88
  Bottom 0.813: JP88.5 JP88.4 JP88.3 JP88.2 JP88.1
N$89
  Bottom 0.813: JP89.1 JP89.2 JP89.3 JP89.4 JP89.5
N$90
  Bottom 0.813: JP90.1 JP90.2 JP90.3 JP90.4 JP90.5
N$91
  Bottom 0.813: JP91.1 JP91.2 JP91.3 JP91.4 JP91.5
N$92
  Bottom 0.813: JP92.5 JP92.4 JP92.3 JP92.2 JP92.1
N$93
  Bottom 0.813: JP93.5 JP93.4 JP93.3 JP93.2 JP93.1
N$94
  Bottom 0.813: JP94.5 JP94.4 JP94.3 JP94.2 JP94.1
N$95
  Bottom 0.813: JP95.1 JP95.2 JP95.3 JP95.4 JP95.5
N$96
  Bottom 0.813: JP96.5 JP96.4 JP96.3 JP96.2 JP96.1
N$97
  Bottom 0.813: JP97.5 JP97.4 JP97.3 JP97.2 JP97.1
N$98
  Bottom 0.813: JP98.1 JP98.2 JP98.3 JP98.4 JP98.5
N$99
  Bottom 0.813: JP99.5 JP99.4 JP99.3 JP99.2 JP99.1
N$100
  Bottom 0.813: JP100.1 JP100.2 JP100.3 JP100.4 JP100.5
N$101
  Bottom 0.813: JP101.1 JP101.2 JP101.3 JP101.4 JP101.5
N$102
  Bottom 0.813: JP102.5 JP102.4 JP102.3 JP102.2 JP102.1
N$103
  Bottom 0.813: JP103.1 JP103.2 JP103.3 JP103.4 JP103.5
N$104
  Bottom 0.813: JP104.5 JP104.4 JP104.3 JP104.2 JP104.1
N$105
  Bottom 0.813: JP105.1 JP105.2 JP105.3 JP105.4 JP105.5
N$106
  Bottom 0.813: JP106.5 JP106.4 JP106.3 JP106.2 JP106.1
N$107
  Bottom 0.813: JP107.1 JP107.2 JP107.3 JP107.4 JP107.5
N$108
  Bottom 0.813: JP108.5 JP108.4 JP108.3 JP108.2 JP108.1
N$109
  Bottom 0.813: JP109.5 JP109.4 JP109.3 JP109.2 JP109.1
N$110
  Bottom 0.813: JP110.1 JP110.2 JP110.3 JP110.4 JP110.5
N$111
  Bottom 0.813: JP111.5 JP111.4 JP111.3 JP111.2 JP111.1
N$112
  Bottom 0.813: JP112.1 JP112.2 JP112.3 JP112.4 JP112.5
N$113
  Bottom 0.813: JP113.1 JP113.2 JP113.3 JP113.4 JP113.5
N$114
  Bottom 0.813: JP114.5 JP114.4 JP114.3 JP114.2 JP114.1
N$115
  Bottom 0.813: JP115.1 JP115.2 JP115.3 JP115.4 JP115.5
N$116
  Bottom 0.813: JP116.1 JP116.2 JP116.3 JP116.4 JP116.5
N$117
  Bottom 0.813: JP117.5 JP117.4 JP117.3 JP117.2 JP117.1
N$118
  Bottom 0.813: JP118.5 JP118.4 JP118.3 JP118.2 JP118.1
N$119
  Bottom 0.813: JP119.1 JP119.2 JP119.3 JP119.4 JP119.5
N$120
  Bottom 0.813: JP120.5 JP120.4 JP120.3 JP120.2 JP120.1
N$121
  Bottom 0.813: JP121.5 JP121.4 JP121.3 JP121.2 JP121.1
N$122
  Bottom 0.813: JP122.1 JP122.2 JP122.3 JP122.4 JP122.5
N$123
  Bottom 0.813: JP123.5 JP123.4 JP123.3 JP123.2 JP123.1
N$124
  Bottom 0.813: JP124.5 JP124.4 JP124.3 JP124.2 JP124.1
N$125
  Bottom 0.813: JP125.5 JP125.4 JP125.3 JP125.2 JP125.1
N$126
  Bottom 0.813: JP126.5 JP126.4 JP126.3 JP126.2 JP126.1
N$127
  Bottom 0.813: JP127.1 JP127.2 JP127.3 JP127.4 JP127.5
N$128
  Bottom 0.813: JP128.1 JP128.2 JP128.3 JP128.4 JP128.5
N$130
  Bottom 0.813: JP140.1 JP140.2 JP140.3 JP140.4 JP140.5
N$131
  Bottom 0.813: JP141.5 JP141.4 JP141.3 JP141.2 JP141.1
N$132
  Bottom 0.813: JP142.1 JP142.2 JP142.3 JP142.4 JP142.5
N$133
  Bottom 0.813: JP143.1 JP143.2 JP143.3 JP143.4 JP143.5
N$134
  Bottom 0.813: JP144.5 JP144.4 JP144.3 JP144.2 JP144.1
N$135
  Bottom 0.813: JP145.1 JP145.2 JP145.3 JP145.4 JP145.5
V+BOT  (via drill 1.27)
  Top 0.813: v189.23,36.75 189.23,24.29 JP147.3
  Bottom 0.813: JP147.3 189.39,21.75 185.42,17.78 185.42,10.16 182.88,7.62 JP135.5 JP135.4 JP135.3 JP135.2 JP135.1 JP134.29 JP134.28 JP134.27 JP134.26 JP134.25 JP134.24 JP134.23 JP134.22 JP134.21 JP134.20 JP134.19 JP134.18 JP134.17 JP134.16 JP134.15 JP134.14 JP134.13 JP134.12 JP134.11 JP134.10 JP134.9 JP134.8 JP134.7 JP134.6 JP134.5 JP134.4 JP134.3 JP134.2 JP134.1 JP4.29 JP4.28 JP4.27 JP4.26 JP4.25 JP4.24 JP4.23 JP4.22 JP4.21 JP4.20 JP4.19 JP4.18 JP4.17 JP4.16 JP4.15 JP4.14 JP4.13 JP4.12 JP4.11 JP4.10 JP4.9 JP4.8 JP4.7 JP4.6 JP4.5 JP4.4 JP4.3 JP4.2 JP4.1 12.7,7.62 10.16,10.16 10.16,13.97 3.81,20.32 JP149.1
V+TOP  (via drill 1.3)
  Top 0.813: v6.35,21.75 6.35,22.86 5.08,24.13 2.54,24.13 1.27,25.4 1.27,34.21 JP146.2
  Bottom 0.813: JP146.2 3.89,36.83 8.89,36.83 13.97,41.91 13.97,50.8 16.51,53.34 JP2.1 JP2.2 JP2.3 JP2.4 JP2.5 JP2.6 JP2.7 JP2.8 JP2.9 JP2.10 JP2.11 JP2.12 JP2.13 JP2.14 JP2.15 JP2.16 JP2.17 JP2.18 JP2.19 JP2.20 JP2.21 JP2.22 JP2.23 JP2.24 JP2.25 JP2.26 JP2.27 JP2.28 JP2.29 JP130.1 JP130.2 JP130.3 JP130.4 JP130.5 JP130.6 JP130.7 JP130.8 JP130.9 JP130.10 JP130.11 JP130.12 JP130.13 JP130.14 JP130.15 JP130.16 JP130.17 JP130.18 JP130.19 JP130.20 JP130.21 JP130.22 JP130.23 JP130.24 JP130.25 JP130.26 JP130.27 JP130.28 JP130.29 JP131.1 JP131.2 JP131.3 JP131.4 JP131.5 179.07,53.34 181.61,50.8 181.61,42.16 184.15,39.62 190.25,39.62 191.77,38.1 JP148.2
V-BOT  (via drill 1.27)
  Top 0.813: v189.23,41.75 189.48,41.66 189.48,40.64 190.75,39.37 193.04,39.37 194.31,38.1 194.31,29.21 191.85,26.75 JP147.2
  Bottom 0.813: 181.61,26.67 181.61,12.7 179.07,10.16 JP136.5 JP136.4 JP136.3 JP136.2 JP136.1 JP133.29 JP133.28 JP133.27 JP133.26 JP133.25 JP133.24 JP133.23 JP133.22 JP133.21 JP133.20 JP133.19 JP133.18 JP133.17 JP133.16 JP133.15 JP133.14 JP133.13 JP133.12 JP133.11 JP133.10 JP133.9 JP133.8 JP133.7 JP133.6 JP133.5 JP133.4 JP133.3 JP133.2 JP133.1 JP3.29 JP3.28 JP3.27 JP3.26 JP3.25 JP3.24 JP3.23 JP3.22 JP3.21 JP3.20 JP3.19 JP3.18 JP3.17 JP3.16 JP3.15 JP3.14 JP3.13 JP3.12 JP3.11 JP3.10 JP3.9 JP3.8 JP3.7 JP3.6 JP3.5 JP3.4 JP3.3 JP3.2 JP3.1 16.51,10.16 13.97,12.7 13.97,24.13 5.08,24.13 3.81,25.4 JP149.2 | JP147.2 191.69,26.67 181.61,26.67 | 181.61,26.67 v181.61,29.21
V-TOP  (via drill 1.27)
  Top 0.813: v6.35,26.67 6.35,34.29 | 6.35,34.29 6.35,39.21 JP146.3 | v13.97,34.29 6.35,34.29
  Bottom 0.813: JP146.3 6.19,41.75 10.16,45.72 10.16,53.34 12.7,55.88 JP1.1 JP1.2 JP1.3 JP1.4 JP1.5 JP1.6 JP1.7 JP1.8 JP1.9 JP1.10 JP1.11 JP1.12 JP1.13 JP1.14 JP1.15 JP1.16 JP1.17 JP1.18 JP1.19 JP1.20 JP1.21 JP1.22 JP1.23 JP1.24 JP1.25 JP1.26 JP1.27 JP1.28 JP1.29 JP129.1 JP129.2 JP129.3 JP129.4 JP129.5 JP129.6 JP129.7 JP129.8 JP129.9 JP129.10 JP129.11 JP129.12 JP129.13 JP129.14 JP129.15 JP129.16 JP129.17 JP129.18 JP129.19 JP129.20 JP129.21 JP129.22 JP129.23 JP129.24 JP129.25 JP129.26 JP129.27 JP129.28 JP129.29 JP132.1 JP132.2 JP132.3 JP132.4 JP132.5 182.88,55.88 185.42,53.34 185.42,49.53 191.77,43.18 JP148.1

### Text on the board
Bottom: V10
tPlace: Solderable Breadboard Large | 1 | 2 | 3 | 4 | 5 | 6 | 7 | 8 | 9 | 10 | 11 | 12 | 13 | 14 | 15 | 16 | 17 | 18 | 19 | 20 | 21 | 22 | 23 | 24 | 25 | 26 | 27 | 28 | 29 | 30 | 31 | 32 | 33 | 34 | 35 | 36 | 37 | 38 | 39 | 40 | 41 | 42 | 43 | 44 | 45 | 46 | 47 | 48 | 49 | 50 | 51 | 52 | 53 | 54 | 55 | 56 | 57 | 58 | 59 | 60 | 61 | 62 | 63 | j | j | i | i | - | - | h | h | g | g | + | + | f | f | GND | GND | e | e | - | - | d | d | c | c | + | + | b | b | a | a | 1 | 2 | 3 | 4 | 5 | 6 | 7 | 8 | 9 | 10 | 11 | 12 | 13 | 14 | 15 | 16 | 17 | 18 | 19 | 20 | 21 | 22 | 23 | 24 | 25 | 26 | 27 | 28 | 29 | 30 | 31 | 32 | 33 | 34 | 35 | 36 | 37 | 38 | 39 | 40 | 41 | 42 | 43 | 44 | 45 | 46 | 47 | 48 | 49 | 50 | 51 | 52 | 53 | 54 | 55 | 56 | 57 | 58 | 59 | 60 | 61 | 62 | 63
bPlace: Solderable Breadboard Large | 1 | 2 | 3 | 4 | 5 | 6 | 7 | 8 | 9 | 10 | 11 | 12 | 13 | 14 | 15 | 16 | 17 | 18 | 19 | 20 | 21 | 22 | 23 | 24 | 25 | 26 | 27 | 28 | 29 | 30 | 31 | 32 | 33 | 34 | 35 | 36 | 37 | 38 | 39 | 40 | 41 | 42 | 43 | 44 | 45 | 46 | 47 | 48 | 49 | 50 | 51 | 52 | 53 | 54 | 55 | 56 | 57 | 58 | 59 | 60 | 61 | 62 | 63 | j | j | i | i | - | - | h | h | g | g | + | + | f | f | GND | GND | e | e | - | - | d | d | c | c | + | + | b | b | a | a | 1 | 2 | 3 | 4 | 5 | 6 | 7 | 8 | 9 | 10 | 11 | 12 | 13 | 14 | 15 | 16 | 17 | 18 | 19 | 20 | 21 | 22 | 23 | 24 | 25 | 26 | 27 | 28 | 29 | 30 | 31 | 32 | 33 | 34 | 35 | 36 | 37 | 38 | 39 | 40 | 41 | 42 | 43 | 44 | 45 | 46 | 47 | 48 | 49 | 50 | 51 | 52 | 53 | 54 | 55 | 56 | 57 | 58 | 59 | 60 | 61 | 62 | 63
tValues: Byron Jacquot
tDocu: Byron Jacquot